# EAGLE design m8_2_6526 (EAGLE 9.2.0)
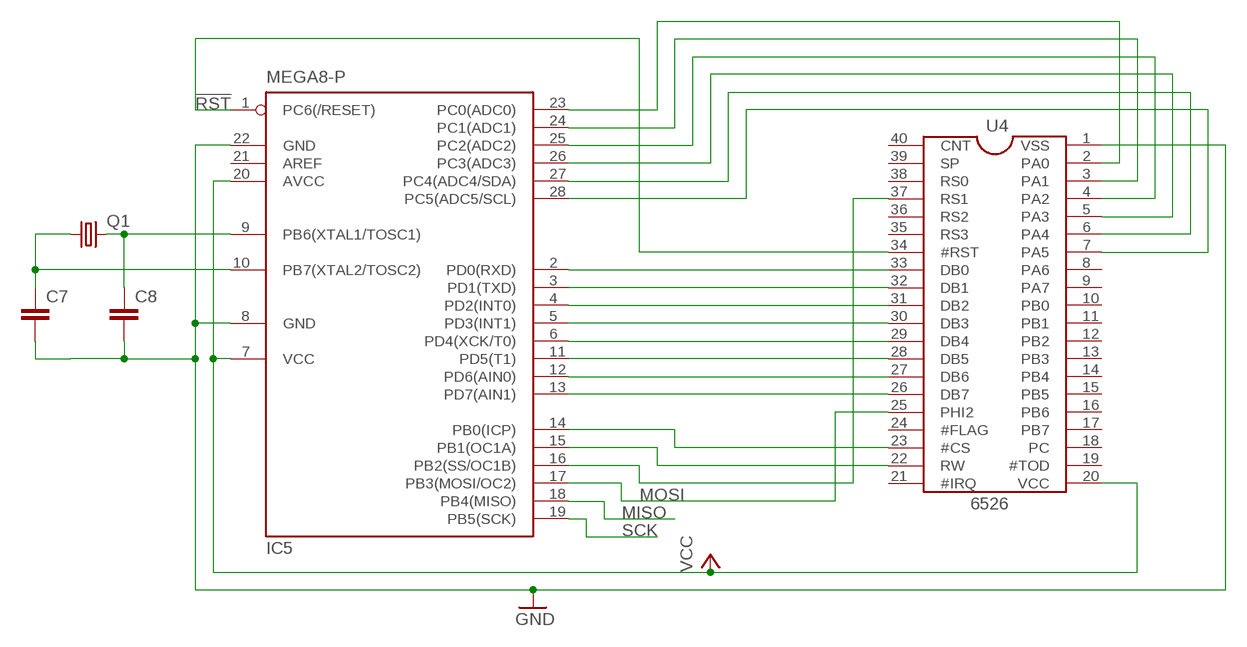
[diagram p0: schematic, sheet 1]

## Parts
C7  C-EU025-025X050  [C025-025X050]
C8  C-EU025-025X050  [C025-025X050]
IC5  MEGA8-P  [DIL28-3]
Q1  CRYSTALHC49S  [HC49/S]
U4  6526  [DIL40]

## Nets
!RST: IC5.1(PC6(/RESET)) U4.34(#RST)
GND: C7.2 C8.2 IC5.8(GND) IC5.22(GND) U4.1(VSS)
MISO: IC5.18(PB4(MISO))
MOSI: IC5.17(PB3(MOSI/OC2)) U4.25(PHI2)
N$11: IC5.2(PD0(RXD)) U4.33(DB0)
N$12: IC5.3(PD1(TXD)) U4.32(DB1)
N$13: IC5.4(PD2(INT0)) U4.31(DB2)
N$14: IC5.5(PD3(INT1)) U4.30(DB3)
N$15: IC5.6(PD4(XCK/T0)) U4.29(DB4)
N$16: IC5.11(PD5(T1)) U4.28(DB5)
N$17: IC5.12(PD6(AIN0)) U4.27(DB6)
N$18: IC5.13(PD7(AIN1)) U4.26(DB7)
N$20: IC5.23(PC0(ADC0)) U4.2(PA0)
N$21: IC5.24(PC1(ADC1)) U4.3(PA1)
N$22: IC5.25(PC2(ADC2)) U4.4(PA2)
N$23: IC5.26(PC3(ADC3)) U4.5(PA3)
N$24: IC5.27(PC4(ADC4/SDA)) U4.6(PA4)
N$25: IC5.28(PC5(ADC5/SCL)) U4.7(PA5)
N$26: IC5.14(PB0(ICP)) U4.23(#CS)
N$27: IC5.15(PB1(OC1A)) U4.22(RW)
N$28: IC5.16(PB2(SS/OC1B)) U4.37(RS1)
N$32: C8.1 IC5.9(PB6(XTAL1/TOSC1)) Q1.2
N$33: C7.1 IC5.10(PB7(XTAL2/TOSC2)) Q1.1
SCK: IC5.19(PB5(SCK))
VCC: IC5.7(VCC) IC5.20(AVCC) U4.20(VCC)
Unconnected: IC5.21(AREF) U4.8(PA6) U4.9(PA7) U4.10(PB0) U4.11(PB1) U4.12(PB2) U4.13(PB3) U4.14(PB4) U4.15(PB5) U4.16(PB6) U4.17(PB7) U4.18(PC) U4.19(#TOD) U4.21(#IRQ) U4.24(#FLAG) U4.35(RS3) U4.36(RS2) U4.38(RS0) U4.39(SP) U4.40(CNT)

## Library data of the parts
C7 C8 = rcl:C-EU: CAPACITOR, European symbol; SPICEPREFIX: C
IC5 = atmel:MEGA8-P: MICROCONTROLLER 8 Kbytes FLASH, 1 kbytes SRAM, 512 bytes EEPROM, USART, 4-channel 10 bit ADC, 2-channel 8 bit ADC Pin compatible with Atmega48, ATMega88, ATMega168 Source: avr.lbr; OC_FARNELL: unknown; OC_NEWARK: unknown
Q1 = crystal:CRYSTAL: CRYSTAL; OC_FARNELL: 1667008; OC_NEWARK: unknown
U4 = commodore:6526: Complex Interface Adapter

## Board
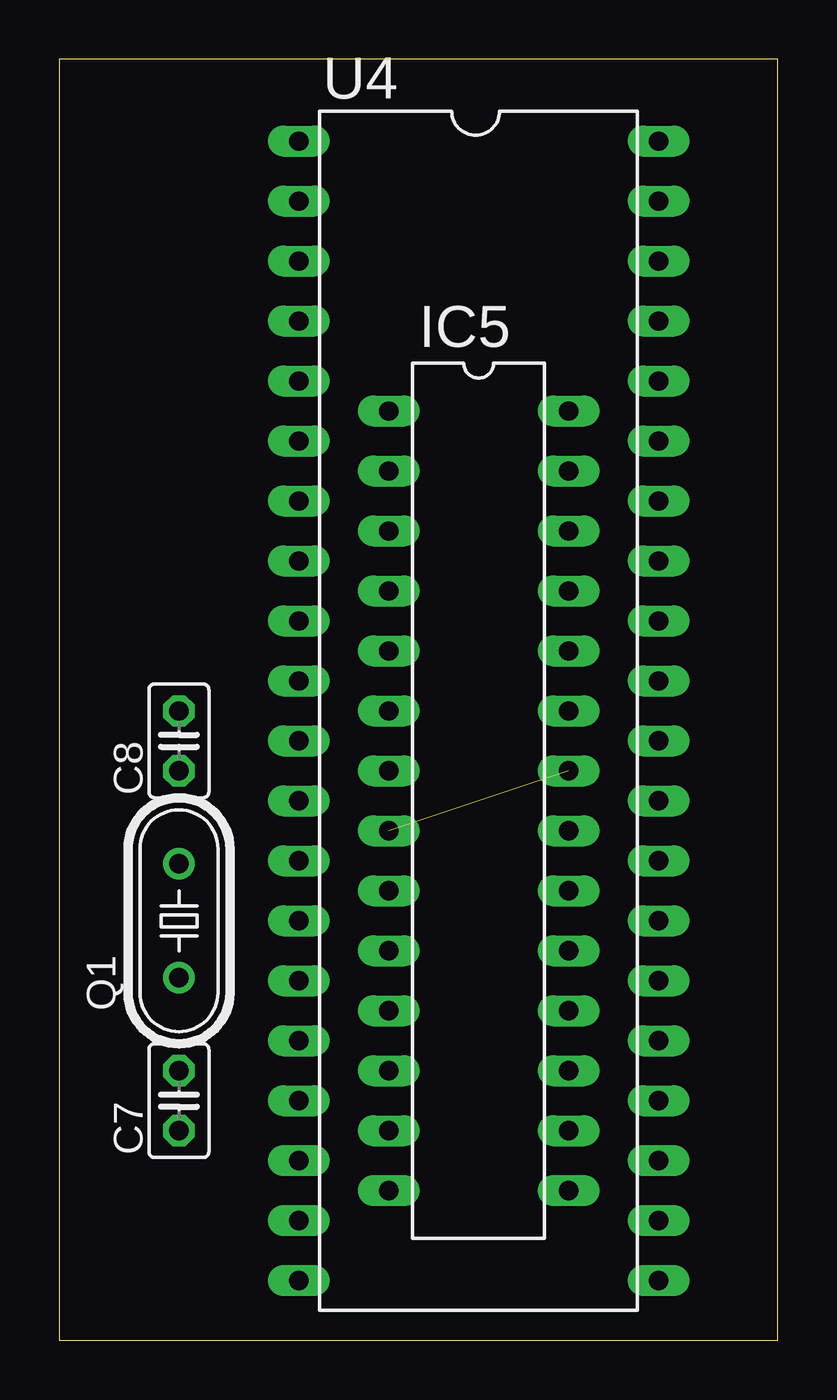
[diagram p1: board, top side]
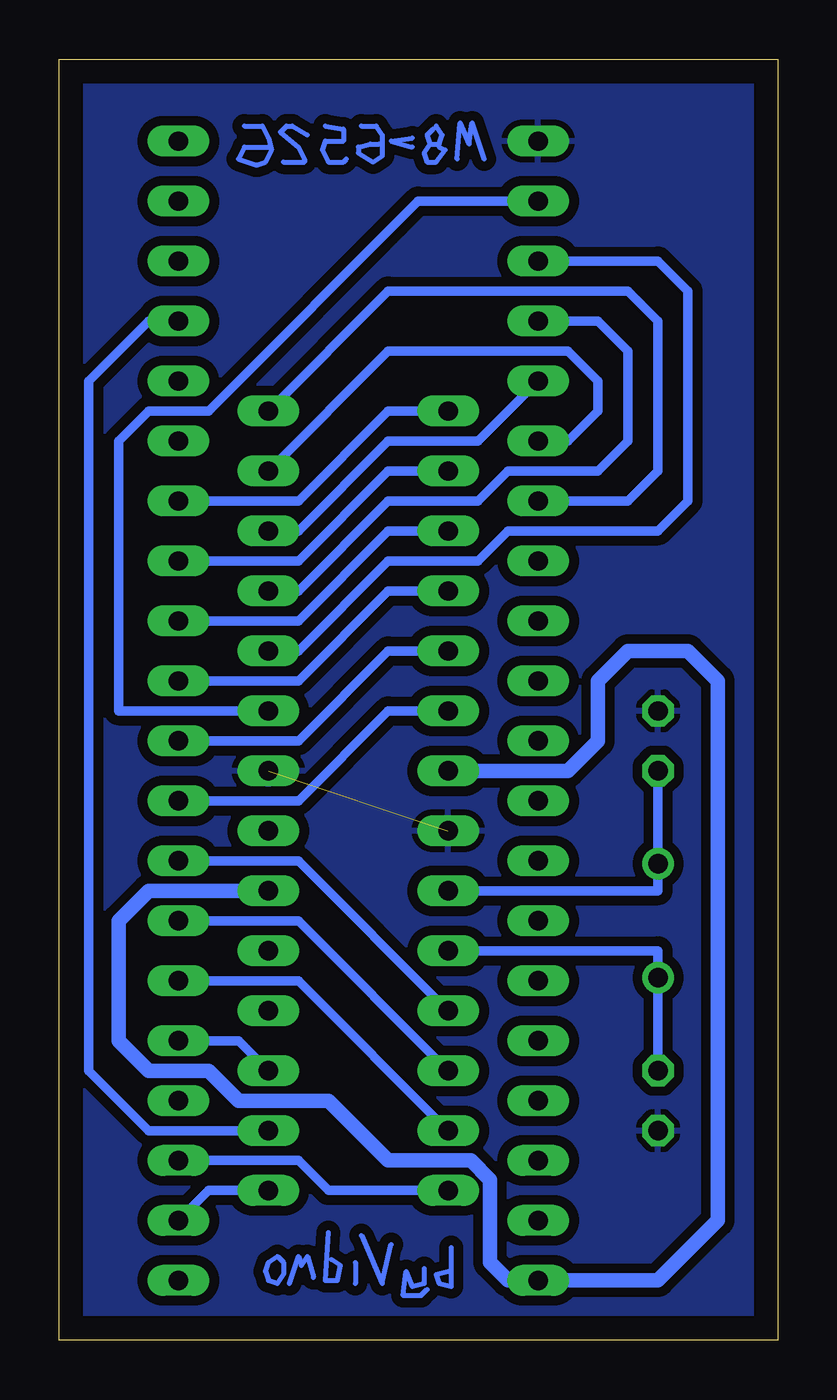
[diagram p2: board, bottom side, seen from below]

Size 30.46 x 54.28 mm. Coordinates in mm from the lower left corner, seen from the top.
Outline: 0,0 30.46,0 30.46,54.28 0,54.28 0,0
Copper layers (1*16): Top 0.035mm / dielectric 1.5mm / Bottom 0.035mm
Design rules "default": minimum track width 6mil, minimum drill 0.35mm, track to track 6mil, track to pad 6mil, pad to pad 6mil, via to via 6mil, smd to smd 6mil, copper to edge 40mil, drill to drill 6mil, minimum pad ring 10mil, minimum via ring 8mil, stop-mask expansion 4mil, vias tented up to drill 0mil, thermal gap 10mil

### Footprints (pad centres in the part's own frame; a part is rotated, then mirrored left to right if it is on the bottom)
C025-025X050 = drill 0.813 octagon: 1 -1.27,0; 2 1.27,0
DIL28-3 = drill 0.813 long: 1 -16.51,-3.81; 2 -13.97,-3.81; 3 -11.43,-3.81; 4 -8.89,-3.81; 5 -6.35,-3.81; 6 -3.81,-3.81; 7 -1.27,-3.81; 8 1.27,-3.81; 9 3.81,-3.81; 10 6.35,-3.81; 11 8.89,-3.81; 12 11.43,-3.81; 13 13.97,-3.81; 14 16.51,-3.81; 15 16.51,3.81; 16 13.97,3.81; 17 11.43,3.81; 18 8.89,3.81; 19 6.35,3.81; 20 3.81,3.81; 21 1.27,3.81; 22 -1.27,3.81; 23 -3.81,3.81; 24 -6.35,3.81; 25 -8.89,3.81; 26 -11.43,3.81; 27 -13.97,3.81; 28 -16.51,3.81
HC49/S = drill 0.813: 1 -2.413,0; 2 2.413,0
DIL40 = drill 0.813 long: 1 -24.13,-7.62; 2 -21.59,-7.62; 3 -19.05,-7.62; 4 -16.51,-7.62; 5 -13.97,-7.62; 6 -11.43,-7.62; 7 -8.89,-7.62; 8 -6.35,-7.62; 9 -3.81,-7.62; 10 -1.27,-7.62; 11 1.27,-7.62; 12 3.81,-7.62; 13 6.35,-7.62; 14 8.89,-7.62; 15 11.43,-7.62; 16 13.97,-7.62; 17 16.51,-7.62; 18 19.05,-7.62; 19 21.59,-7.62; 20 24.13,-7.62; 21 24.13,7.62; 22 21.59,7.62; 23 19.05,7.62; 24 16.51,7.62; 25 13.97,7.62; 26 11.43,7.62; 27 8.89,7.62; 28 6.35,7.62; 29 3.81,7.62; 30 1.27,7.62; 31 -1.27,7.62; 32 -3.81,7.62; 33 -6.35,7.62; 34 -8.89,7.62; 35 -11.43,7.62; 36 -13.97,7.62; 37 -16.51,7.62; 38 -19.05,7.62; 39 -21.59,7.62; 40 -24.13,7.62

### Placement (x,y rotation side)
C7  5.08,10.16 270 top
C8  5.08,25.4 90 top
IC5  17.78,22.86 270 top
Q1  5.08,17.78 90 top
U4  17.78,26.67 270 top

### Tracks (layer width: path | path; a pad name or v marks a point on that pad's centre or on a via)
!RST
  Bottom 0.406: U4.34 20.32,35.56 16.51,39.37 IC5.1
GND  (1 unrouted)
  pour Bottom (isolate 0.406): -1.27,-1.27 -1.27,55.88 31.75,55.88 31.75,-1.27
MOSI
  Bottom 0.406: U4.25 22.86,12.7 IC5.17
N$1
  Bottom 0.203: 12.45,50.04 12.95,51.56 13.08,50.67 13.46,51.56 13.59,50.04
N$2
  Bottom 0.203: 14.48,51.44 14.22,51.05 14.35,50.67 14.73,50.67 | 14.73,50.67 14.99,50.29 14.86,49.91 14.48,49.91 14.1,50.42 14.35,50.55 | 14.73,50.67 14.86,51.05 14.61,51.31
N$3
  Bottom 0.203: 15.49,50.93 16.38,50.8 15.49,50.55
N$4
  Bottom 0.203: 17.65,51.44 17.02,51.44 16.76,51.05 16.76,50.16 17.14,49.91 17.78,50.29 17.78,50.55 17.27,50.67 16.89,50.67
N$5
  Bottom 0.203: 19.18,51.44 18.41,51.31 18.41,50.8 19.18,50.8 19.3,50.42 19.05,49.91 18.41,49.91 18.29,50.04
N$6
  Bottom 0.203: 19.94,51.05 20.57,51.44 20.83,51.44 21.08,51.18 20.32,50.55 20.07,50.04 20.07,49.91 20.95,49.91
N$7
  Bottom 0.203: 22.61,51.44 21.84,51.44 21.59,50.93 21.46,50.42 21.72,49.91 22.1,49.78 22.86,50.04 22.61,50.55 21.59,50.55
N$8
  Bottom 0.203: 13.84,3.94 13.84,2.29 14.35,2.41 14.48,2.79 13.97,2.92
N$9
  Bottom 0.203: 16.38,4.06 16.76,2.41 17.65,4.45
N$10
  Bottom 0.203: 17.91,3.3 17.91,2.41
N$11
  Bottom 0.406: U4.33 20.32,33.02 16.51,36.83 IC5.2
N$12
  Bottom 0.406: U4.32 20.32,30.48 16.51,34.29 IC5.3
N$13
  Bottom 0.406: U4.31 20.32,27.94 16.51,31.75 IC5.4
N$14
  Bottom 0.406: U4.30 20.32,25.4 16.51,29.21 IC5.5
N$15
  Bottom 0.406: U4.29 20.32,22.86 16.51,26.67 IC5.6
N$16
  Bottom 0.406: IC5.11 20.32,20.32 U4.28
N$17
  Bottom 0.406: IC5.12 20.32,17.78 U4.27
N$18
  Bottom 0.406: IC5.13 20.32,15.24 U4.26
N$20
  Bottom 0.406: IC5.23 27.94,26.67 27.94,38.1 26.67,39.37 24.13,39.37 15.24,48.26 U4.2
N$21
  Bottom 0.406: IC5.24 20.32,29.21 16.51,33.02 12.7,33.02 11.43,34.29 5.08,34.29 3.81,35.56 3.81,44.45 5.08,45.72 U4.3
N$22
  Bottom 0.406: IC5.25 20.32,31.75 16.51,35.56 12.7,35.56 11.43,36.83 7.62,36.83 6.35,38.1 6.35,41.91 7.62,43.18 U4.4
N$23
  Bottom 0.406: IC5.26 20.32,34.29 16.51,38.1 12.7,38.1 U4.5
N$24
  Bottom 0.406: IC5.27 16.51,41.91 8.89,41.91 7.62,40.64 7.62,39.37 8.89,38.1 U4.6
N$25
  Bottom 0.406: IC5.28 16.51,44.45 6.35,44.45 5.08,43.18 5.08,36.83 6.35,35.56 U4.7
N$26
  Bottom 0.406: U4.23 20.32,7.62 19.05,6.35 IC5.14
N$27
  Bottom 0.406: U4.22 24.13,6.35 IC5.15
N$28
  Bottom 0.406: IC5.16 26.67,8.89 29.21,11.43 29.21,40.64 26.67,43.18 U4.37
N$30
  Bottom 0.203: 18.92,3.43 18.54,3.17 18.67,2.54 19.18,2.54 19.05,4.57
N$31
  Bottom 0.203: 19.68,2.67 19.94,3.56 20.19,3.17 20.32,3.56 20.7,2.41
N$32
  Bottom 0.406: IC5.9 5.08,19.05 Q1.2 C8.1
N$33
  Bottom 0.406: IC5.10 5.08,16.51 Q1.1 C7.1
N$34
  Bottom 0.203: 21.21,3.56 20.95,3.3 20.95,2.79 21.21,2.41 21.59,2.54 21.72,2.92 21.59,3.3 21.21,3.56
N$35
  Bottom 0.203: 14.99,3.05 14.99,2.41 15.49,2.29 15.75,2.92 15.88,1.91 15.11,1.91 14.86,2.16
VCC
  Bottom 0.61: IC5.7 8.89,24.13 7.62,25.4 7.62,27.94 6.35,29.21 3.81,29.21 2.54,27.94 2.54,5.08 5.08,2.54 U4.20 11.43,2.54 12.19,3.3 12.19,6.81 13,7.62 16.51,7.62 19.05,10.16 22.86,10.16 24.13,11.43 26.67,11.43 27.94,12.7 27.94,17.78 26.67,19.05 IC5.20